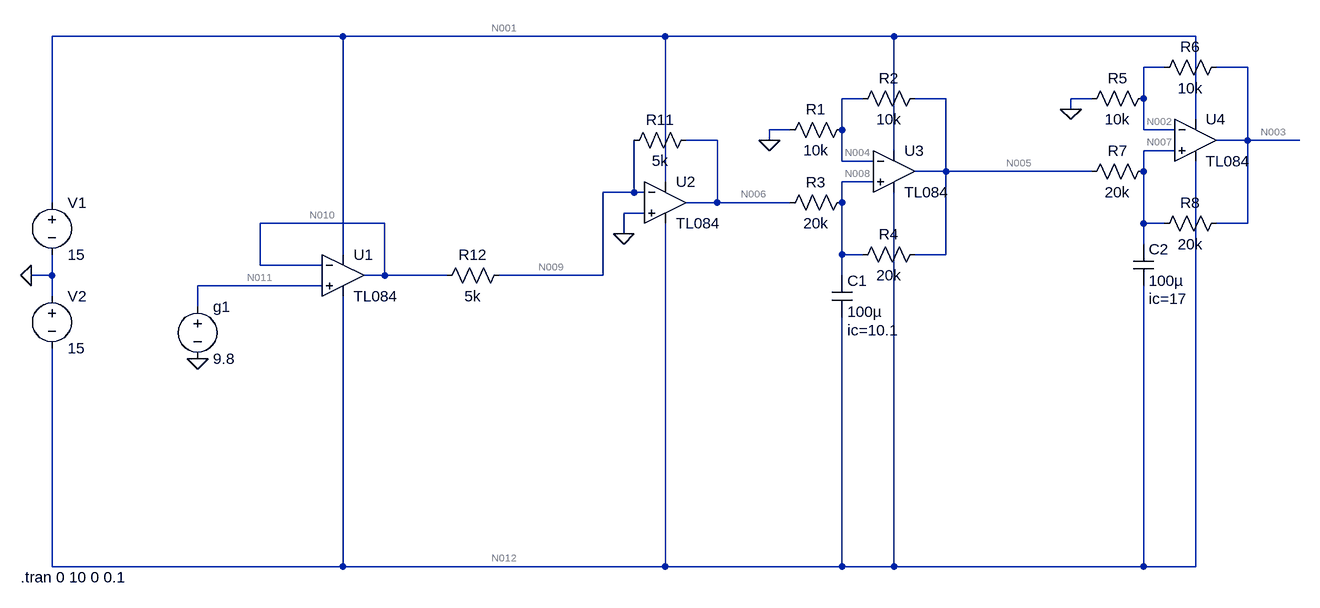
[diagram p0: schematic freefall.asc]
* freefall.asc
V§g1 N011 0 9.8
R1 N004 0 10k
R2 N005 N004 10k
R3 N008 N006 20k
R4 N005 N008 20k
C1 N008 N012 100µ ic=10.1
R5 N002 0 10k
R6 N003 N002 10k
R7 N007 N005 20k
R8 N003 N007 20k
C2 N007 N012 100µ ic=17
R11 N006 N009 5k
R12 N009 N010 5k
V1 N001 0 15
V2 0 N012 15
* U1: TL084 (symbol Auto\TL084 not available, pins judged from their places): In+=N011 In-=N010 V+=N001 V-=N012 OUT=N010
* U2: TL084 (symbol Auto\TL084 not available, pins judged from their places): In+=0 In-=N009 V+=N001 V-=N012 OUT=N006
* U3: TL084 (symbol Auto\TL084 not available, pins judged from their places): In+=N008 In-=N004 V+=N001 V-=N012 OUT=N005
* U4: TL084 (symbol Auto\TL084 not available, pins judged from their places): In+=N007 In-=N002 V+=N001 V-=N012 OUT=N003
.tran 0 10 0 0.1
.backanno
.end

* Results of the author's LTspice run, read from the files saved beside the schematic
* Operating Point, zero values left out:
*   V(n011) = 9.8 V
*   V(n004) = -4.9 V
*   V(n005) = -9.8 V
*   V(n008) = -4.9 V
*   V(n006) = -9.8 V
*   V(n012) = -15 V
*   V(n002) = 2 V
*   V(n003) = 4 V
*   V(n007) = 2 V
*   V(n009) = 56.58 µV
*   V(n010) = 9.8 V
*   V(n001) = 15 V
*   I(C1) = -490 µA
*   I(C2) = -490 µA
*   I(R1) = -490 µA
*   I(R2) = -490 µA
*   I(R3) = 245 µA
*   I(R4) = -245 µA
*   I(R5) = 200 µA
*   I(R6) = 200 µA
*   I(R7) = 590 µA
*   I(R8) = 99.99 µA
*   I(R11) = -1.96 mA
*   I(R12) = -1.96 mA
*   I(G1) = -54.89 pA
*   I(V1) = -56.78 mA
*   I(V2) = -55.79 mA
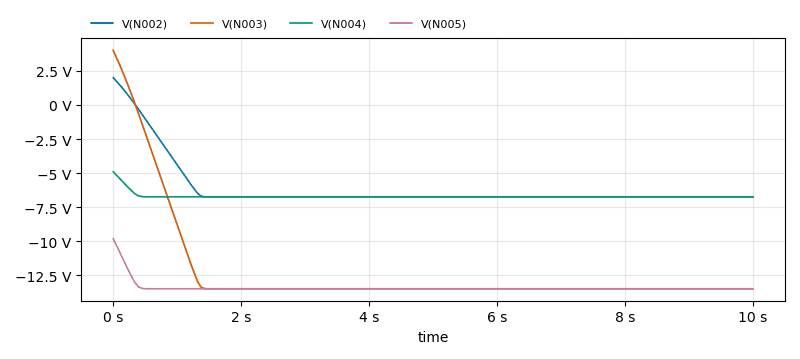
[diagram p1: Transient Analysis of freefall.asc, plotted from the saved traces]
* Transient Analysis, 1 run:
*   V(N002): min -6.739 V, max 2 V, average -6.13 V, rms 6.391 V, last -6.739 V
*   V(N003): min -13.48 V, max 4 V, average -12.26 V, rms 12.78 V, last -13.48 V
*   V(N004): min -6.739 V, max -4.9 V, average -6.703 V, rms 6.707 V, last -6.739 V
*   V(N005): min -13.48 V, max -9.8 V, average -13.41 V, rms 13.41 V, last -13.48 V